# EAGLE design main (EAGLE 6.5.0)
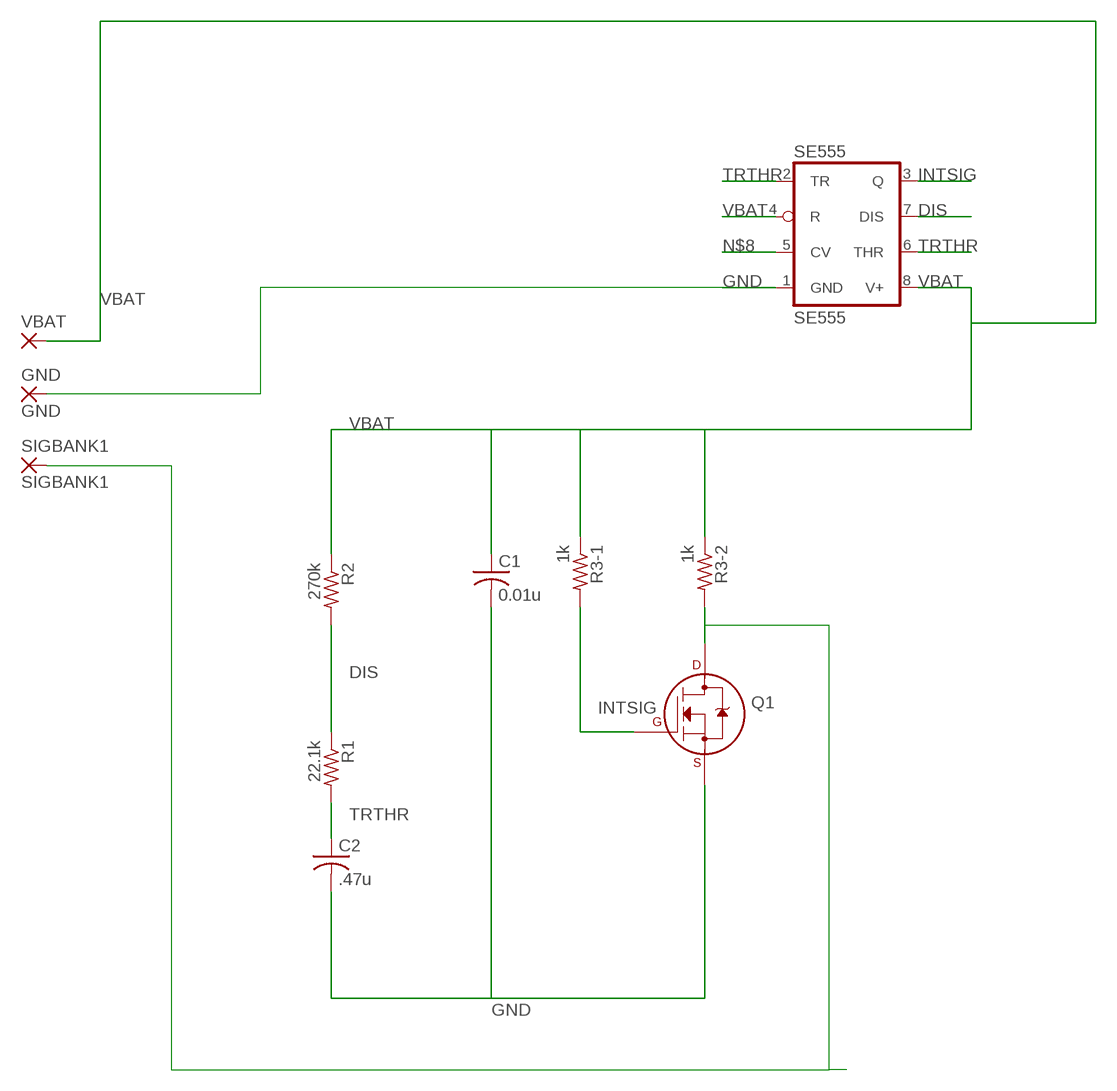
[diagram p0: schematic, sheet 1]

## Parts
C1  0.01u  C-USC0805  [C0805]
C2  .47u  C-USC0805  [C0805]
GND  GND  3,17/1,3  [3,17/1,3]
Q1  2N7002_SOT23  [SOT-23]
R1  22.1k  R-US_R0805  [R0805]
R2  270k  R-US_R0805  [R0805]
R3-1  1k  R-US_R0805  [R0805]
R3-2  1k  R-US_R0805  [R0805]
SE555  SE555  LM555D  [SO08]
SIGBANK1  SIGBANK1  3,17/1,3  [3,17/1,3]
VBAT  3,17/1,3  [3,17/1,3]

## Nets
DIS: R1.1 R2.2 SE555.7(DIS)
GND: C1.2 C2.2 GND.1(P) Q1.2(S) SE555.1(GND)
INTSIG: Q1.1(G) R3-1.2 SE555.3(Q)
N$8: SE555.5(CV)
SIGBANK1: Q1.3(D) R3-2.2 SIGBANK1.1(P)
TRTHR: C2.1 R1.2 SE555.2(TR) SE555.6(THR)
VBAT: C1.1 R2.1 R3-1.1 R3-2.1 SE555.4(R) SE555.8(V+) VBAT.1(P)

## Library data of the parts
C1 C2 = adafruit:C-US: CAPACITOR, American symbol
GND SIGBANK1 VBAT = wirepad:3,17/1,3: THROUGH-HOLE PAD
Q1 = transistors:2N700*: 2N7000, 2N7002, NDS7002A N-channel enhancement mode MOSFET
R1 R2 R3-1 R3-2 = adafruit:R-US_: RESISTOR, American symbol
SE555 = linear:*555: TIMER

## Board
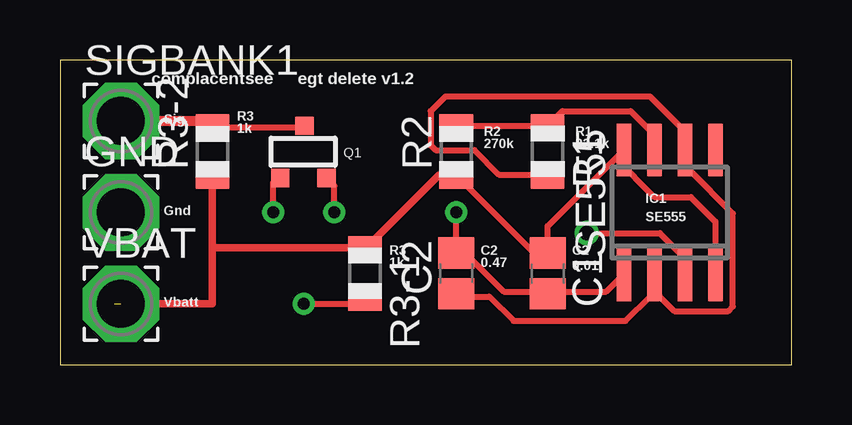
[diagram p1: board, top side]
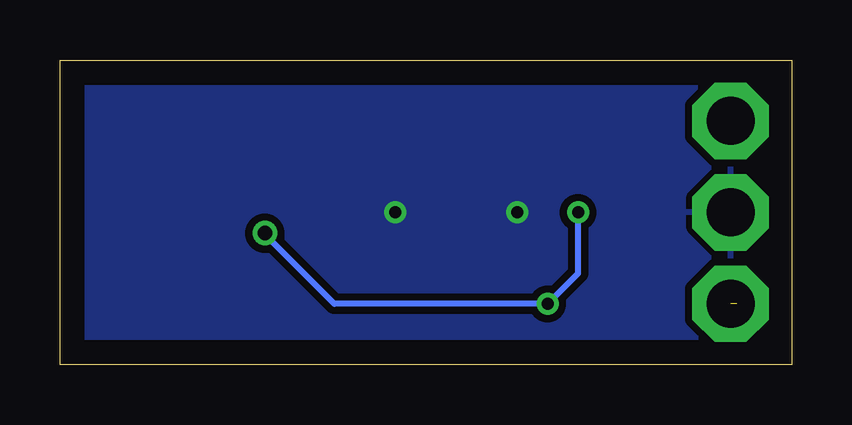
[diagram p2: board, bottom side, seen from below]

Size 30.48 x 12.7 mm. Coordinates in mm from the lower left corner, seen from the top.
Outline: 0,0 30.48,0 30.48,12.7 0,12.7 0,0
Copper layers (1*16): Top 0.035mm / dielectric 1.5mm / Bottom 0.035mm
Design rules "default": minimum track width 10mil, minimum drill 24mil, track to track 8mil, track to pad 8mil, pad to pad 8mil, via to via 8mil, smd to smd 8mil, copper to edge 40mil, drill to drill 8mil, minimum pad ring 10mil, minimum via ring 8mil, stop-mask expansion 4mil, vias tented up to drill 0mil, thermal gap 10mil

### Footprints (pad centres in the part's own frame; a part is rotated, then mirrored left to right if it is on the bottom)
C0805 = smd 1.3 x 1.5: 1 -0.85,0; 2 0.85,0
3,17/1,3 = drill 2 pad 3.175 octagon: 1 0,0
SOT-23 = smd 0.762 x 0.762: 1 -0.979,-1.101; 2 0.94,-1.101; 3 0.025,1.067
R0805 = smd 1.1 x 1.4: 1 -1,0; 2 1,0
SO08 = smd 0.6 x 2.2: 1 -1.905,-2.6; 2 -0.635,-2.6; 3 0.635,-2.6; 4 1.905,-2.6; 5 1.905,2.6; 6 0.635,2.6; 7 -0.635,2.6; 8 -1.905,2.6

### Placement (x,y rotation side)
C1  20.32,3.81 270 top
C2  16.51,3.81 90 top
GND  2.54,6.35 0 top
Q1  10.16,8.89 0 top
R1  20.32,8.89 270 top
R2  16.51,8.89 90 top
R3-1  12.7,3.81 270 top
R3-2  6.35,8.89 90 top
SE555  25.4,6.35 0 top
SIGBANK1  2.54,10.16 0 top
VBAT  2.54,2.54 0 top

### Tracks (layer width: path | path; a pad name or v marks a point on that pad's centre or on a via)
DIS
  Top 0.254: 20.32,9.96 16.66,9.96 R2.2 | 20.32,9.96 20.93,10.57 23.77,10.57 24.59,9.75 24.59,9.14 SE555.7 | 20.32,9.96 R1.1
GND  (via drill 0.51)
  Top 0.254: 20.32,3.05 22.76,3.05 23.37,3.66 SE555.1 | 20.32,3.05 18.49,3.05 17.07,4.47 16.66,4.47 C2.2 v16.51,6.35 | 20.32,3.05 C1.2 | v11.43,6.35 11.43,7.46 Q1.2
  pour Bottom (isolate 0.305): 0,12.7 30.48,12.7 30.48,0 0,0
INTSIG  (via drill 0.51, 0.61)
  Top 0.254: 9.14,7.72 Q1.1 9.18,7.62 8.89,7.62 v8.89,6.35 | 12.6,2.64 R3-1.2 12.7,2.54 v10.16,2.54 | v21.95,5.49 24.99,5.49 26.01,4.47 26.01,3.86 SE555.3
  Bottom 0.254: v8.89,6.35 8.89,3.81 v10.16,2.54 19.05,2.54 21.95,5.44 v21.95,5.49
SIGBANK1
  Top 0.254: R3-2.2 10.12,9.89 Q1.3
  Top 0.406: SIGBANK1.1 6.35,10.16 R3-2.2
TRTHR
  Top 0.254: 24.59,2.85 23.57,1.83 18.9,1.83 17.88,2.85 16.66,2.85 C2.1 | 24.59,2.85 24.59,3.66 SE555.2 24.59,2.85 | R1.2 20.32,7.92 18.29,7.92 17.27,8.94 15.65,8.94 15.44,9.14 15.44,10.57 16.05,11.18 24.59,11.18 26.01,9.75 26.01,9.14 SE555.6 26.21,8.94 26.21,8.13 28.04,6.3 28.04,2.44 27.84,2.23 25.6,2.23 24.99,2.85 24.59,2.85
VBAT  (1 unrouted)
  Top 0.254: 12.6,4.88 R3-1.1 | 15.78,7.89 R2.1 19.74,4.66 C1.1 20.32,5.78 23.15,8.6 | 23.15,8.6 SE555.8 | SE555.4 27.3,5.97 26.29,6.99 24.77,6.99 23.15,8.6
  Top 0.305: R3-1.1 15.78,7.89 | 6.35,4.88 R3-2.1 | 6.35,4.88 12.6,4.88 | 6.35,4.88 6.35,2.54 2.29,2.54

### Text on the board
tPlace: complacentsee | egt delete v1.2 | Sig | 1k | R3 | R2 | R1 | 270k | 22.1k | IC1 | Gnd | SE555 | R3 | C2 | C2 | 1k | 0.47 | 0.01 | Vbatt